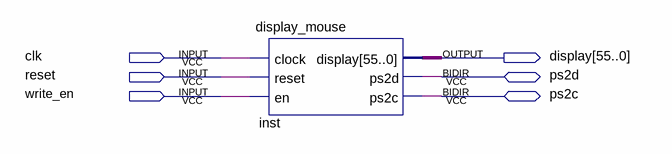
[diagram p0: schematic sheet]
// Quartus schematic mouse_display.bdf as structural Verilog: 1 symbols, 6 pins
module mouse_display (
  input  clk,
  input  reset,
  input  write_en,
  inout  ps2d,
  inout  ps2c,
  output [55:0] display
);

  display_mouse inst (.clock(clk), .reset(reset), .en(write_en), .display(display), .ps2d(ps2d), .ps2c(ps2c));
endmodule
